# Altium schematic sheet synchronous-demodulator.SchDoc: SD Top Level
size A4; DrawnBy: Dylan Vogel; Organization: UTAT SS; DocumentNumber: 6; Revision: 2; SheetNumber: 6; SheetTotal: 13
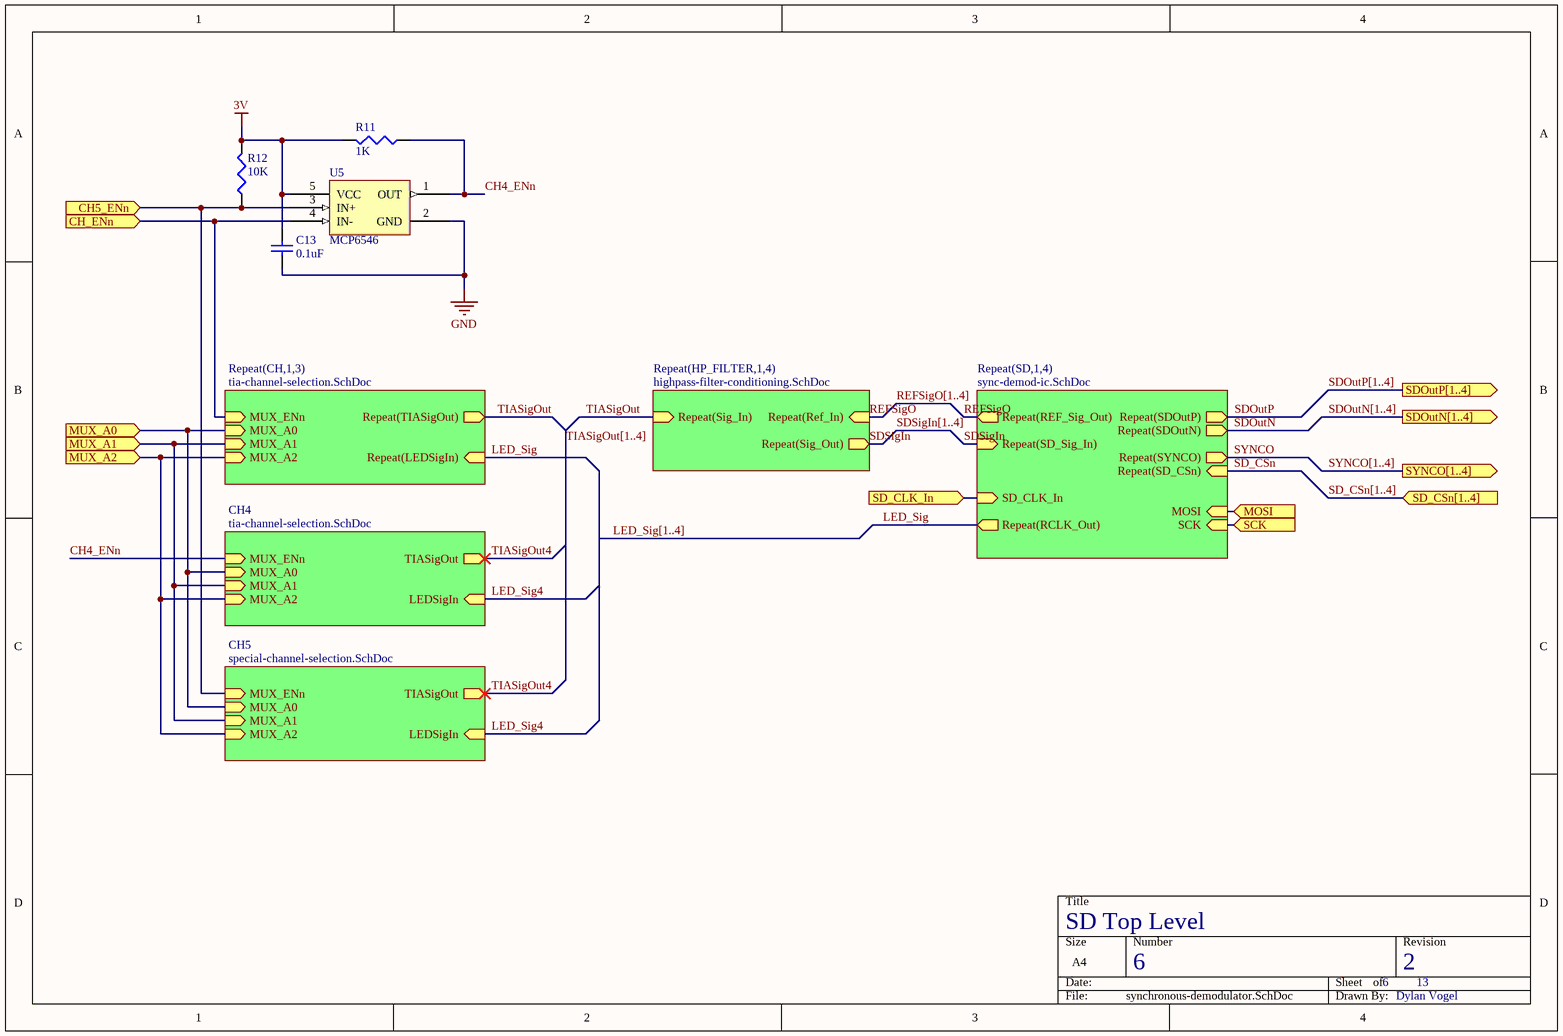
[diagram p0: synchronous-demodulator.SchDoc]

## Parts
C13  0.1uF  [0402]
R11  1K  [0402]
R12  10K  [0402]
U5  MCP6546  [SOT-23-5_95P290X160-5N]

## Sub-sheets
CH4 = tia-channel-selection.SchDoc: MUX_ENn (in), MUX_A0 (in), MUX_A1 (in), TIASigOut (out), MUX_A2 (in), LEDSigIn (in)
CH5 = special-channel-selection.SchDoc: MUX_ENn (in), MUX_A0 (in), MUX_A1 (in), TIASigOut (out), MUX_A2 (in), LEDSigIn (in)  | Channel: 5
Repeat(CH,1,3) = tia-channel-selection.SchDoc: MUX_ENn (in), MUX_A0 (in), MUX_A1 (in), Repeat(TIASigOut) (out), MUX_A2 (in), Repeat(LEDSigIn) (in)
Repeat(HP_FILTER,1,4) = highpass-filter-conditioning.SchDoc: Repeat(Ref_In) (in), Repeat(Sig_Out) (out), Repeat(Sig_In) (in)
Repeat(SD,1,4) = sync-demod-ic.SchDoc: Repeat(SDOutP) (out), Repeat(SD_CSn) (in), Repeat(SDOutN) (out), Repeat(RCLK_Out) (out), SD_CLK_In (in), Repeat(SYNCO) (out), Repeat(SD_Sig_In) (in), MOSI (in), SCK (in), Repeat(REF_Sig_Out) (out)

## Ports
CH5_ENn (in), CH_ENn (in), MOSI (in), MUX_A0 (in), MUX_A1 (in), MUX_A2 (in), SCK (in), SD_CLK_In (in), SD_CSn[1..4] (in), SDOutN[1..4] (out), SDOutP[1..4] (out), SYNCO[1..4] (out)

## Nets
3V: C13.2 R11.2 R12.2 U5.5(VCC)
GND: C13.1 U5.2(GND)
CH4_ENn: R11.1 U5.1(OUT) ; sheet CH4/MUX_ENn
CH5_ENn: R12.1 U5.3(IN+) ; port CH5_ENn, sheet CH5/MUX_ENn
CH_ENn: U5.4(IN-) ; port CH_ENn, sheet Repeat(CH,1,3)/MUX_ENn
LED_Sig: sheet Repeat(CH,1,3)/Repeat(LEDSigIn), sheet Repeat(SD,1,4)/Repeat(RCLK_Out)
LED_Sig4: sheet CH4/LEDSigIn, sheet CH5/LEDSigIn
MOSI: port MOSI, sheet Repeat(SD,1,4)/MOSI
MUX_A0: port MUX_A0, sheet Repeat(CH,1,3)/MUX_A0, sheet CH4/MUX_A0, sheet CH5/MUX_A0
MUX_A1: port MUX_A1, sheet Repeat(CH,1,3)/MUX_A1, sheet CH4/MUX_A1, sheet CH5/MUX_A1
MUX_A2: port MUX_A2, sheet Repeat(CH,1,3)/MUX_A2, sheet CH4/MUX_A2, sheet CH5/MUX_A2
REFSigO: sheet Repeat(SD,1,4)/Repeat(REF_Sig_Out), sheet Repeat(HP_FILTER,1,4)/Repeat(Ref_In)
SCK: port SCK, sheet Repeat(SD,1,4)/SCK
SD_CLK_In: port SD_CLK_In, sheet Repeat(SD,1,4)/SD_CLK_In
SD_CSn: sheet Repeat(SD,1,4)/Repeat(SD_CSn)
SDOutN: sheet Repeat(SD,1,4)/Repeat(SDOutN)
SDOutP: sheet Repeat(SD,1,4)/Repeat(SDOutP)
SDSigIn: sheet Repeat(SD,1,4)/Repeat(SD_Sig_In), sheet Repeat(HP_FILTER,1,4)/Repeat(Sig_Out)
SYNCO: sheet Repeat(SD,1,4)/Repeat(SYNCO)
TIASigOut: sheet Repeat(CH,1,3)/Repeat(TIASigOut), sheet Repeat(HP_FILTER,1,4)/Repeat(Sig_In)
TIASigOut4: sheet CH4/TIASigOut, sheet CH5/TIASigOut

## Buses and harness runs
bus LED_Sig[1..4]
bus REFSigO[1..4]
bus SD_CSn[1..4] = port SD_CSn[1..4]
bus SDOutN[1..4] = port SDOutN[1..4]
bus SDOutP[1..4] = port SDOutP[1..4]
bus SDSigIn[1..4]
bus SYNCO[1..4] = port SYNCO[1..4]
bus TIASigOut[1..4]

## Library data of the parts
C13 = Cap Semi: Capacitor (Semiconductor SIM Model); Published: 8-Jun-2000; LatestRevisionDate: 29-May-2009; LatestRevisionNote: IPC-7351 Footprint Added.; PackageReference: C1206; Publisher: Altium Limited; PackageDescription: Chip Capacitor; Value: 0.1uF; Supplier 1: Digi-Key
R11 R12 = Res3: Resistor; Published: 8-Jun-2000; LatestRevisionDate: 29-May-2009; LatestRevisionNote: IPC-7351 Footprint Added.; PackageReference: J1-0603; Publisher: Altium Limited; PackageDescription: Chip Resistor; Supplier 1: Digi-Key
  R11: Value: 1K
  R12: Value: 10K
U5 = MCP6546: Open-drain output sub-microamp comparator.; Supplier 1: Digi-Key; Supplier Part Number 1: MCP6546T-E/OTCT-ND